# Altium project pca10040.PrjPCB (part 2 of 3)

## Sheet sheet4_buttons_and_leds.SchDoc: Buttons and LEDs
size A3; Organization: Nordic Semiconductor; DocumentNumber: 4; Revision: 3.0.0; SheetNumber: 4; SheetTotal: 6; Author: KJP/RUBR/GETR/SIGE; CompanyName: Nordic Semiconductor; DrawnBy: KJP/RUBR/GETR/SIGE; DocumentSize: A3
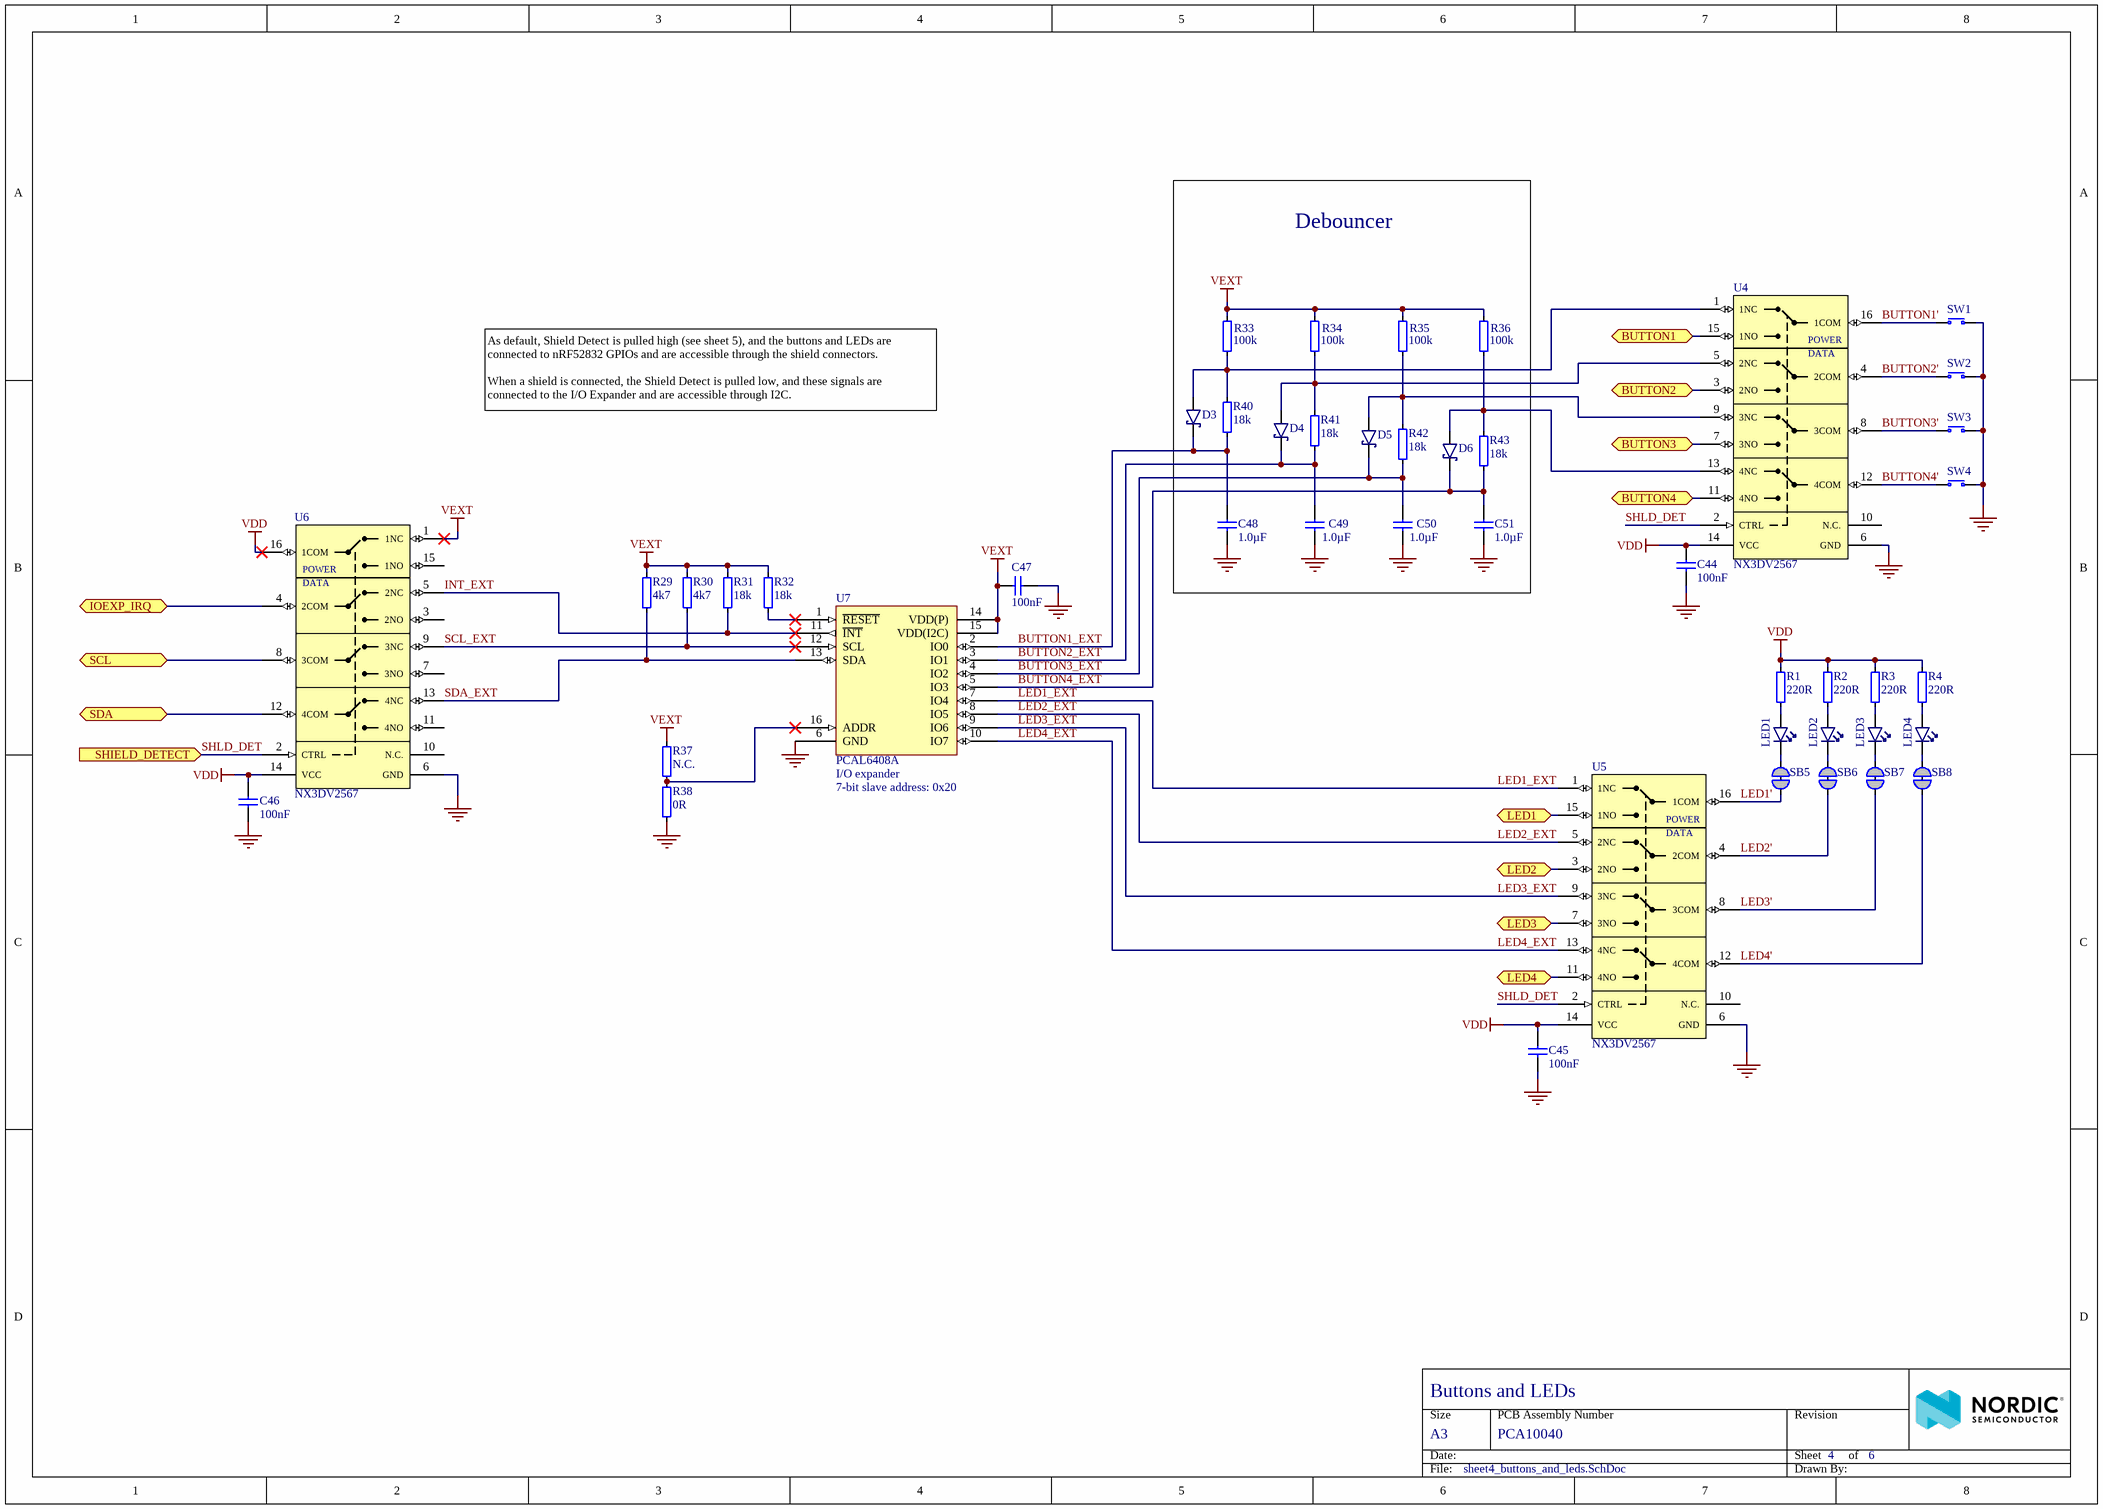
[diagram p3: sheet4_buttons_and_leds.SchDoc]

### Parts
C44  100nF  [CAPC1005X04L]
C45  100nF  [CAPC1005X04L]
C46  100nF  [CAPC1005X04L]
C47  100nF  [CAPC1005X04L]
C48  1.0µF  [CAPC1005X04L]
C49  1.0µF  [CAPC1005X04L]
C50  1.0µF  [CAPC1005X04L]
C51  1.0µF  [CAPC1005X04L]
D3  1PS79SB30.115  [SOD-523]  (value not drawn)
D4  1PS79SB30.115  [SOD-523]  (value not drawn)
D5  1PS79SB30.115  [SOD-523]  (value not drawn)
D6  1PS79SB30.115  [SOD-523]  (value not drawn)
LED1  L0603G  [LED_0603_G]  (value not drawn)
LED2  L0603G  [LED_0603_G]  (value not drawn)
LED3  L0603G  [LED_0603_G]  (value not drawn)
LED4  L0603G  [LED_0603_G]  (value not drawn)
R1  220R  [RESC1005X04L]
R2  220R  [RESC1005X04L]
R3  220R  [RESC1005X04L]
R4  220R  [RESC1005X04L]
R29  4k7  [RESC1005X04L]
R30  4k7  [RESC1005X04L]
R31  18k  [RESC1005X04L]
R32  18k  [RESC1005X04L]
R33  100k  [RESC1005X04L]
R34  100k  [RESC1005X04L]
R35  100k  [RESC1005X04L]
R36  100k  [RESC1005X04L]
R37  N.C.  [RESC1005X04L_NC]
R38  0R  [RESC1005X04L]
R40  18k  [RESC1005X04L]
R41  18k  [RESC1005X04L]
R42  18k  [RESC1005X04L]
R43  18k  [RESC1005X04L]
SB5  Solderbridge  [Solderbridge_Shorted]  (value not drawn)  (net tie, no BOM)
SB6  Solderbridge  [Solderbridge_Shorted]  (value not drawn)  (net tie, no BOM)
SB7  Solderbridge  [Solderbridge_Shorted]  (value not drawn)  (net tie, no BOM)
SB8  Solderbridge  [Solderbridge_Shorted]  (value not drawn)  (net tie, no BOM)
SW1  PB SW  [Switch-PB-6.2x6.3mm-SMD]  (value not drawn)
SW2  PB SW  [Switch-PB-6.2x6.3mm-SMD]  (value not drawn)
SW3  PB SW  [Switch-PB-6.2x6.3mm-SMD]  (value not drawn)
SW4  PB SW  [Switch-PB-6.2x6.3mm-SMD]  (value not drawn)
U4  NX3DV2567  [XQFN40P180X260X50-16N]
U5  NX3DV2567  [XQFN40P180X260X50-16N]
U6  NX3DV2567  [XQFN40P180X260X50-16N]
U7  PCAL6408A  [XQFN40P180X260X50-16N]

### Blocks framed on the sheet
Debouncer: C48-C51 D3-D6 R33-R36 R40-R43

### Ports
BUTTON1 (bidir), BUTTON2 (bidir), BUTTON3 (bidir), BUTTON4 (bidir), IOEXP_IRQ (bidir), LED1 (bidir), LED2 (bidir), LED3 (bidir), LED4 (bidir), SCL (bidir), SDA (bidir), SHIELD_DETECT (in)

### Nets
GND: C44.1 C45.1 C46.1 C47.1 C48.2 C49.1 C50.1 C51.2 R38.1 SW1.1(N.O) SW2.1(N.O) SW3.1(N.O) SW4.1(N.O) U4.6(GND) U5.6(GND) U6.6(GND) U7.6(GND)
VDD: C44.2 C45.2 C46.2 R1.2 R2.2 R3.2 R4.2 U4.14(VCC) U5.14(VCC) U6.14(VCC) U6.16(1COM)
VEXT: C47.2 R29.2 R30.2 R31.2 R32.2 R33.2 R34.2 R35.2 R36.2 R37.2 U6.1(1NC) U7.14(VDD(P)) U7.15(VDD(I2C))
BUTTON1': SW1.2(COM) U4.16(1COM)
BUTTON1_EXT: C48.1 D3.3(C) R40.1 U7.2(IO0)
BUTTON2': SW2.2(COM) U4.4(2COM)
BUTTON2_EXT: C49.2 D4.3(C) R41.1 U7.3(IO1)
BUTTON3': SW3.2(COM) U4.8(3COM)
BUTTON3_EXT: C50.2 D5.3(C) R42.1 U7.4(IO2)
BUTTON4': SW4.2(COM) U4.12(4COM)
BUTTON4_EXT: C51.1 D6.3(C) R43.1 U7.5(IO3)
D2: U4.15(1NO) ; port BUTTON1
D3: U4.3(2NO) ; port BUTTON2
D4: U4.7(3NO) ; port BUTTON3
D5: U4.11(4NO) ; port BUTTON4
D6: U5.15(1NO) ; port LED1
D7: U5.3(2NO) ; port LED2
D8: U5.7(3NO) ; port LED3
D9: U5.11(4NO) ; port LED4
INT_EXT: R31.1 U6.5(2NC) U7.11(~{INT})
LED1': SB5.1 U5.16(1COM)
LED1_EXT: U5.1(1NC) U7.7(IO4)
LED2': SB6.1 U5.4(2COM)
LED2_EXT: U5.5(2NC) U7.8(IO5)
LED3': SB7.1 U5.8(3COM)
LED3_EXT: U5.9(3NC) U7.9(IO6)
LED4': SB8.1 U5.12(4COM)
LED4_EXT: U5.13(4NC) U7.10(IO7)
P0.26: U6.12(4COM) ; port SDA
P0.27: U6.8(3COM) ; port SCL
SCL_EXT: R30.1 U6.9(3NC) U7.12(SCL)
SDA_EXT: R29.1 U6.13(4NC) U7.13(SDA)
SHLD_DET: U4.2(CTRL) U5.2(CTRL) U6.2(CTRL) ; port SHIELD_DETECT
NetD3_1: D3.1(A) R33.1 R40.2 U4.1(1NC)
NetD4_1: D4.1(A) R34.1 R41.2 U4.5(2NC)
NetD5_1: D5.1(A) R35.1 R42.2 U4.9(3NC)
NetD6_1: D6.1(A) R36.1 R43.2 U4.13(4NC)
NetLED1_1: LED1.1(C) SB5.2
NetLED1_2: LED1.2(A) R1.1
NetLED2_1: LED2.1(C) SB6.2
NetLED2_2: LED2.2(A) R2.1
NetLED3_1: LED3.1(C) SB7.2
NetLED3_2: LED3.2(A) R3.1
NetLED4_1: LED4.1(C) SB8.2
NetLED4_2: LED4.2(A) R4.1
NetR32_1: R32.1 U7.1(~{RESET})
NetR37_1: R37.1 R38.2 U7.16(ADDR)
NetSB30_2: U6.4(2COM) ; port IOEXP_IRQ

Not connected (* = marked no-connect by the designer): U4 10(N.C.); U5 10(N.C.); U6 3(2NO) 7(3NO) 10(N.C.) 11(4NO) 15(1NO)

### Notes on the sheet
- As default, Shield Detect is pulled high (see sheet 5), and the buttons and LEDs are connected to nRF52832 GPIOs and are accessible through the shield connectors.
  When a shield is connected, the Shield Detect is pulled low, and these signals are connected to the I/O Expander and are accessible through I2C.
- (near U7) I/O expander
- (near U7) 7-bit slave address: 0x20
- Size
- Date:
- A3
- PCB Assembly Number
- Sheet         of
- Revision
- File:
- Drawn By:
- (in symbol NX3DV2567GU) POWER; DATA

### Library data of the parts
C44-C47 = C0402-100n: Capacitor, X7R, ±10%; Manufacturer: N.A.; Part number IPS: 00000005296; Note: 16V; Artikkelnr Noca: 20039200; Pad Count: 2; Part Number: C0402-100n; Manufacturer Part Number: N.A.; Footprint Doc: 0402; LatestRevisionDate: 2009-11-23; Published: 2009-05-08; Value: 100nF; ComponentLink1URL: N.A.; ComponentLink1Description: Datasheet; ComponentLink2URL: N.A.; ComponentLink2Description: Supplier link; HelpURL: N.A.; Supplier 1: N.A.; Supplier Part Number 1: N.A.; Supplier 2: N.A.; Supplier Part Number 2: N.A.; PartId: 100200184; Component Class: Capacitors; Author: rsk; Part number Norautron: N.A.
C48-C51 = C0402-1µ0: Capacitor, X5R, ±5%, 6.3V; Manufacturer: N.A.; Part number IPS: 00000007786, 00000003457; Artikkelnr Noca: 20039235; Pad Count: 2; Part Number: C0402-1µ0; Manufacturer Part Number: N.A.; Footprint Doc: 0402; LatestRevisionDate: 2016-08-22; Published: 2009-05-08; Value: 1.0µF; Note: 6.3V; ComponentLink1URL: N.A.; ComponentLink1Description: Datasheet; ComponentLink2URL: N.A.; ComponentLink2Description: Supplier link; HelpURL: N.A.; Supplier 1: Digi-Key; Supplier Part Number 1: 1276-1444-1-ND; Supplier 2: N.A.; Supplier Part Number 2: N.A.; PartId: 100200190; Component Class: Capacitors; Author: rsk; Part number Norautron: N.A.
D3-D6 = 1PS79SB30.115: Diode Schottky Vf=0.38, Vr=40V, If=200mA, Ir=500nA; Manufacturer: NXP Semiconductors; Note: N.A.; Artikkelnr Noca: 10029120; Pad Count: 2; Part Number: 1PS79SB30.115; Manufacturer Part Number: 1PS79SB30.115; Footprint Doc: SOD-523; LatestRevisionDate: 2016-08-26; Published: 2014-09-24; Value: 1PS79SB30.115; Part number IPS: N.A.; ComponentLink1URL: N.A.; ComponentLink1Description: Datasheet; ComponentLink2URL: N.A.; ComponentLink2Description: Supplier link; HelpURL: http://www.nxp.com/documents/data_sheet/1PS79SB30.pdf; Supplier 1: Digi-Key; Supplier Part Number 1: 568-5973-1-ND; Supplier 2: Farnell; Supplier Part Number 2: 873-4097; PartId: 101300094; Component Class: Semiconductors; Author: rsk; Part number Norautron: N.A.
LED1-LED4 = LG L29K Smartled Green: LED, Green, 0603, 570nm, Vf=1.7V, 2.24..5.6mcd, - 40 to +100°C; Manufacturer: Osram; Manufacturer Part Number: LG L29K-G2J1-24-Z; Part number IPS: 00000009961; Part number Norautron: N.A.; Note: 2.24..5.6 mcd, Vfmin=1.7V; Artikkelnr Noca: 13019147; Pad Count: 2; Part Number: LG L29K Smartled Green; Footprint Doc: 0603; LatestRevisionDate: 2017-08-21; Published: 2014-10-28; Value: L0603G; ComponentLink1URL: N.A.; ComponentLink1Description: Datasheet; ComponentLink2URL: N.A.; ComponentLink2Description: Supplier link; HelpURL: http://www.osram-os.com/Graphics/XPic2/00077107_0.pdf; Supplier 1: Digi-Key; Supplier Part Number 1: 475-2709-1-ND; Supplier 2: Mouser; Supplier Part Number 2: 720-LGL29KG2J124Z; PartId: 101400096; Component Class: Optoelectronics; Author: rsk
R1-R4 = R0402-220: Resistor, ±1%, 0.063W; Manufacturer: N.A.; Note: Chip Res 1%; Artikkelnr Noca: 27049057; Pad Count: 2; Part Number: R0402-220; Manufacturer Part Number: N.A.; LatestRevisionDate: 2009-11-23; Published: 2009-05-08; Value: 220R; Footprint Doc: 0402; Part number IPS: N.A.; ComponentLink1URL: N.A.; ComponentLink1Description: Datasheet; ComponentLink2URL: N.A.; ComponentLink2Description: Supplier link; HelpURL: N.A.; Supplier 1: Farnell; Supplier Part Number 1: 173-8841; Supplier 2: N.A.; Supplier Part Number 2: N.A.; PartId: 100100156; Component Class: Resistors; Author: rsk; Part number Norautron: N.A.
R29 R30 = R0402-4k7: Resistor, ±1%, 0.063W; Manufacturer: N.A.; Part number IPS: 00000003433; Note: Chip Res 1%; Artikkelnr Noca: 27049089; Pad Count: 2; Part Number: R0402-4k7; Manufacturer Part Number: N.A.; Footprint Doc: 0402; LatestRevisionDate: 2009-11-23; Published: 2009-05-08; Value: 4k7; ComponentLink1URL: N.A.; ComponentLink1Description: Datasheet; ComponentLink2URL: N.A.; ComponentLink2Description: Supplier link; HelpURL: N.A.; Supplier 1: Farnell; Supplier Part Number 1: 173-8858; Supplier 2: N.A.; Supplier Part Number 2: N.A.; PartId: 100100190; Component Class: Resistors; Author: rsk; Part number Norautron: N.A.
R31 R32 R40-R43 = R0402-18k: Resistor, ±1%, 0.063W; Manufacturer: N.A.; Part number IPS: 00000003300; Note: Chip Res 1%; Artikkelnr Noca: 27049103; Pad Count: 2; Part Number: R0402-18k; Manufacturer Part Number: N.A.; Footprint Doc: 0402; LatestRevisionDate: 2009-11-23; Published: 2009-05-08; Value: 18k; ComponentLink1URL: N.A.; ComponentLink1Description: Datasheet; ComponentLink2URL: N.A.; ComponentLink2Description: Supplier link; HelpURL: N.A.; Supplier 1: Farnell; Supplier Part Number 1: 173-8867; Supplier 2: N.A.; Supplier Part Number 2: N.A.; PartId: 100100208; Component Class: Resistors; Author: rsk; Part number Norautron: N.A.
R33-R36 = R0402-100k: Resistor, ±1%, 0.063W; Manufacturer: N.A.; Part number IPS: 00000003667; Note: Chip Res 1%; Artikkelnr Noca: 27049121; Pad Count: 2; Part Number: R0402-100k; Manufacturer Part Number: N.A.; Footprint Doc: 0402; LatestRevisionDate: 2009-11-23; Published: 2009-05-08; Value: 100k; ComponentLink1URL: N.A.; ComponentLink1Description: Datasheet; ComponentLink2URL: N.A.; ComponentLink2Description: Supplier link; HelpURL: N.A.; Supplier 1: Farnell; Supplier Part Number 1: 173-8877; Supplier 2: N.A.; Supplier Part Number 2: N.A.; PartId: 100100239; Component Class: Resistors; Author: rsk; Part number Norautron: N.A.
R37 = R0402-N.C.: Not mounted; Manufacturer: N.A.; Note: Chip Res; Assembly: Not mounted; Pad Count: 2; Part Number: R0402-N.C.; Manufacturer Part Number: N.A.; Footprint Doc: 0402; LatestRevisionDate: 2009-05-08; Published: 2009-05-08; Value: N.C.; Artikkelnr Noca: N.A.; Part number IPS: N.A.; ComponentLink1URL: N.A.; ComponentLink1Description: Datasheet; ComponentLink2URL: N.A.; ComponentLink2Description: Supplier link; HelpURL: N.A.; Supplier 1: N.A.; Supplier Part Number 1: N.A.; Supplier 2: N.A.; Supplier Part Number 2: N.A.; PartId: 100100281; Component Class: Resistors; Author: rsk; Part number Norautron: N.A.
R38 = R0402-0R: Resistor, ±5%, 0.063W; Manufacturer: N.A.; Part number IPS: 00000007128; Note: Chip Res 5%; Artikkelnr Noca: 27049000; Pad Count: 2; Part Number: R0402-0R; Manufacturer Part Number: N.A.; Footprint Doc: 0402; LatestRevisionDate: 2009-11-23; Published: 2009-05-08; Value: 0R; ComponentLink1URL: N.A.; ComponentLink1Description: Datasheet; ComponentLink2URL: N.A.; ComponentLink2Description: Supplier link; HelpURL: N.A.; Supplier 1: Farnell; Supplier Part Number 1: 146-9661; Supplier 2: N.A.; Supplier Part Number 2: N.A.; PartId: 100100109; Component Class: Resistors; Author: rsk; Part number Norautron: N.A.
SB5-SB8 = Solderbridge Shorted: Shorted Solderbridge; Manufacturer: N.A.; Pad Count: 2; Part Number: Solderbridge Shorted; Manufacturer Part Number: N.A.; LatestRevisionDate: 2012-08-07; Published: 2012-08-07; Value: Solderbridge; Note: N.A.; Artikkelnr Noca: N.A.; Footprint Doc: Solderbridge_Shorted; Part number IPS: N.A.; ComponentLink1URL: N.A.; ComponentLink1Description: Datasheet; ComponentLink2URL: N.A.; ComponentLink2Description: Supplier link; HelpURL: N.A.; Supplier 1: N.A.; Supplier Part Number 1: N.A.; Supplier 2: N.A.; Supplier Part Number 2: N.A.; PartId: 100500459; Component Class: Connectors; Author: rsk; Part number Norautron: N.A.
SW1-SW4 = Switch-PB-6.2x6.3mm-SMD: Tactile Switch, SPNO, SMD, 160gf, 6.2x6.3x2.5mm; Manufacturer: Dailywell; Manufacturer Part Number: TS604VM1-025BR-R; Part number IPS: 00000007812; Note: N.A.; Artikkelnr Noca: 50019106; Pad Count: 4; Part Number: Switch-PB-6.2x6.3mm-SMD; Footprint Doc: Switch-PB-6.2x6.3mm-SMD; LatestRevisionDate: 2016-04-21; Published: 2010-02-01; Value: PB SW; ComponentLink1URL: N.A.; ComponentLink1Description: Datasheet; ComponentLink2URL: N.A.; ComponentLink2Description: Supplier link; HelpURL: \\hizz\pro\app9717\Datasheet\switches\Dailywell\TS604VM1-025BR-R.pdf; Supplier 1: Cabcon; Supplier Part Number 1: TS604VM1-025BR-R; Supplier 2: Mouser; Supplier Part Number 2: 688-SKHUALE010; PartId: 101500001; Component Class: Switches; Author: rsk; Part number Norautron: N.A.
U4-U6 = NX3DV2567GU: Low-ohmic four-pole double-throw analog switch; Manufacturer: NXP Semiconductors; Part number IPS: 00000007816; Pad Count: 16; Note: N.A.; Artikkelnr Noca: 15079317; Part Number: NX3DV2567GU; PartId: 101900290; Component Class: Misc_ICs; Author: rsk; Manufacturer Part Number: NX3DV2567GU; ComponentLink1URL: N.A.; ComponentLink1Description: Datasheet; ComponentLink2URL: N.A.; ComponentLink2Description: Supplier link; HelpURL: http://www.nxp.com/documents/data_sheet/NX3DV2567.pdf; Footprint Doc: XQFN-16; LatestRevisionDate: 2015-02-17; Published: 2015-02-17; Value: NX3DV2567; Supplier 1: Digi-Key; Supplier Part Number 1: 568-5206-1-ND; Supplier 2: Mouser; Supplier Part Number 2: 771-NX3DV2567GU115; Part number Norautron: N.A.
U7 = PCAL6408AHK: 8-bit I2C-bus I/O expander with interrupt output; Manufacturer: NXP Semiconductors; Part number IPS: 00000009987; Note: N.A.; Artikkelnr Noca: 15079321; Pad Count: 16; Part Number: PCAL6408AHK; Manufacturer Part Number: PCAL6408AHK; Footprint Doc: XQFN-16; LatestRevisionDate: 2015-04-29; Published: 2015-04-29; Value: PCAL6408A; ComponentLink1URL: N.A.; ComponentLink1Description: Datasheet; ComponentLink2URL: N.A.; ComponentLink2Description: Supplier link; HelpURL: http://www.nxp.com/documents/data_sheet/PCAL6408A.pdf; Supplier 1: Digi-Key; Supplier Part Number 1: 568-9944-1-ND; Supplier 2: Mouser; Supplier Part Number 2: 771-PCAL6408AHKX; PartId: 101900289; Component Class: Misc_ICs; Author: rsk; Part number Norautron: N.A.

## Sheet sheet5_connectors.SchDoc: Connectors
size A3; Organization: Nordic Semiconductor; DocumentNumber: 5; Revision: 3.0.0; SheetNumber: 5; SheetTotal: 6; Author: KJP/RUBR/GETR/SIGE; CompanyName: Nordic Semiconductor; DrawnBy: KJP/RUBR/GETR/SIGE; DocumentSize: A3
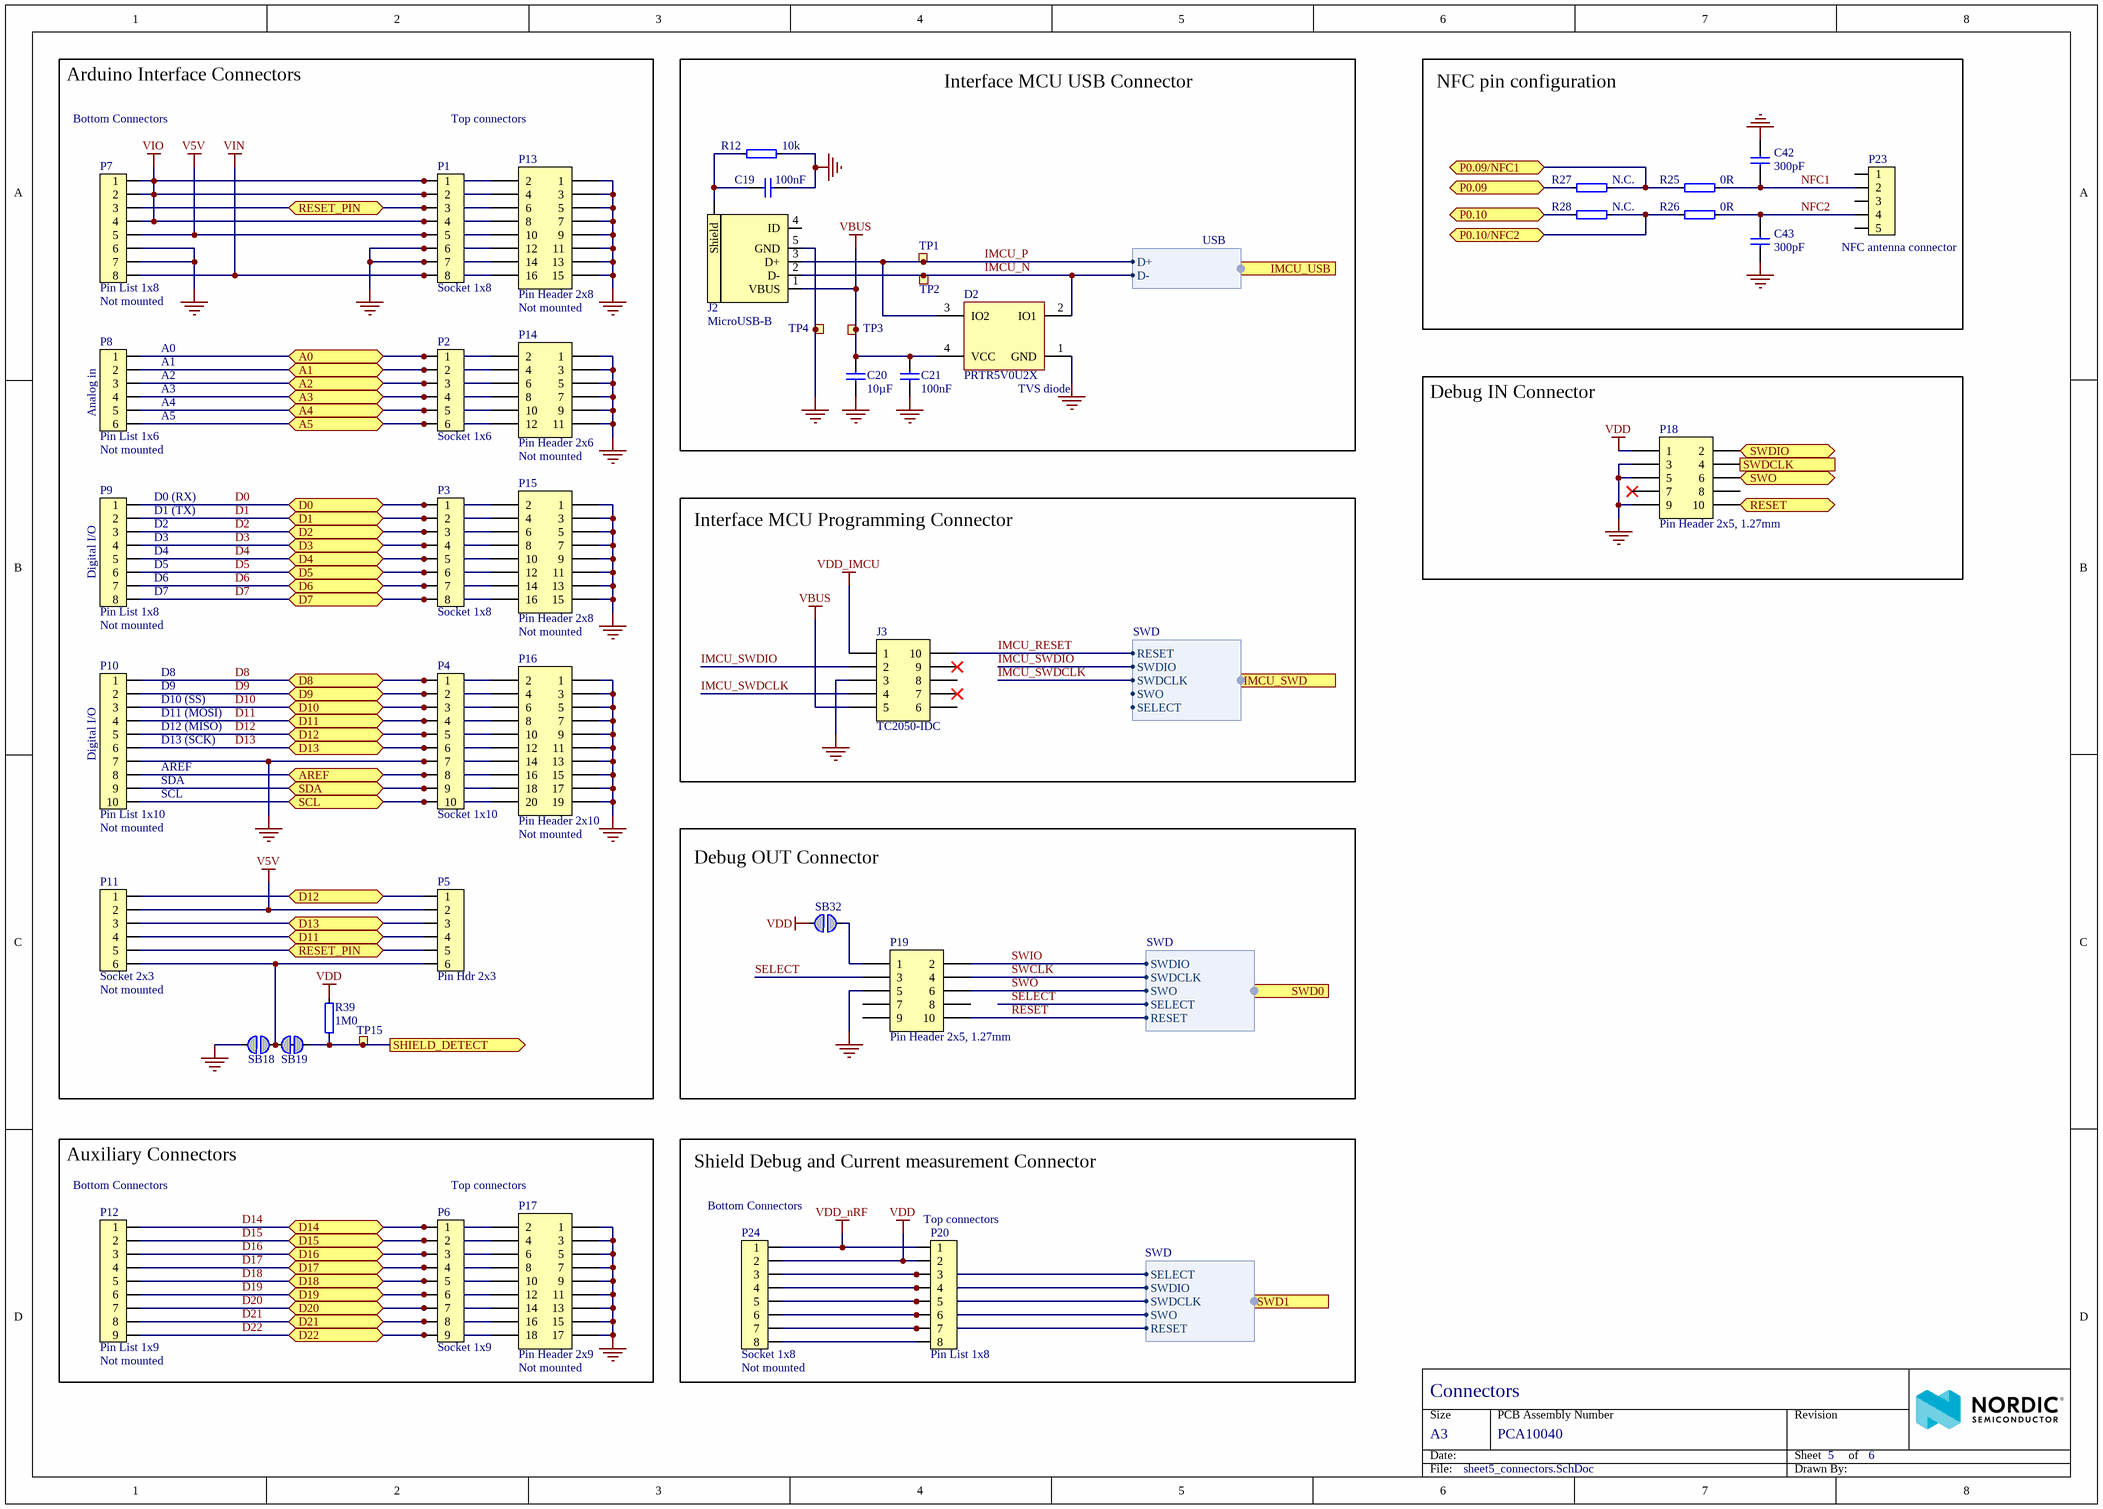
[diagram p4: sheet5_connectors.SchDoc]

### Parts
C19  100nF  [CAPC1005X04L]
C20  10µF  [CAPC1608X06L]
C21  100nF  [CAPC1005X04L]
C42  300pF  [CAPC1005X04L]
C43  300pF  [CAPC1005X04L]
D2  PRTR5V0U2X  [SOT190P230X110-4L]
J2  MicroUSB-B  [USB-Micro-B-RA-SMD-PiP]
J3  TC2050-IDC  [TC2050-IDC-NLFP]  (no BOM)
P1  Socket 1x8  [SOCKET_1x8_SMD]
P2  Socket 1x6  [SOCKET_1x6_SMD]
P3  Socket 1x8  [SOCKET_1x8_SMD]
P4  Socket 1x10  [SOCKET_1x10_SMD]
P5  Pin Hdr 2x3  [HDR_2x3-SMD]
P6  Socket 1x9  [SOCKET_1x9_SMD]
P7  Pin List 1x8  Assembly: Not mounted  [LIST_1x8_SMD-NC]
P8  Pin List 1x6  Assembly: Not mounted  [LIST_1x6_SMD-NC]
P9  Pin List 1x8  Assembly: Not mounted  [LIST_1x8_SMD-NC]
P10  Pin List 1x10  Assembly: Not mounted  [LIST_1x10_SMD-NC]
P11  Socket 2x3  Assembly: Not mounted  [SOCKET_2x3_SMD-2.54mm-bottom-NC]
P12  Pin List 1x9  Assembly: Not mounted  [LIST_1x9_SMD-NC]
P13  Pin Header 2x8  Assembly: Not mounted  [HDR_2x8-NC]
P14  Pin Header 2x6  Assembly: Not mounted  [HDR_2x6-NC]
P15  Pin Header 2x8  Assembly: Not mounted  [HDR_2x8-NC]
P16  Pin Header 2x10  Assembly: Not mounted  [HDR_2x10-NC]
P17  Pin Header 2x9  Assembly: Not mounted  [HDR_2x9-NC]
P18  Pin Header 2x5, 1.27mm  [HDR_2x5-SMD-1.27mm-K]
P19  Pin Header 2x5, 1.27mm  [HDR_2x5-SMD-1.27mm-K]
P20  Pin List 1x8  [LIST_1x8_SMD]
P23  FPC 0.5mm RA SMD  [FPC_05P-0.5mm-RA-SMD]  (value not drawn)
P24  Socket 1x8  Assembly: Not mounted  [LIST_1x8_SMD-NC]
R12  10k  [RESC1005X04L]
R25  0R  [RESC1005X04L]
R26  0R  [RESC1005X04L]
R27  N.C.  [RESC1005X04L_NC]
R28  N.C.  [RESC1005X04L_NC]
R39  1M0  [RESC1005X04L]
SB18  Solderbridge  [Solderbridge]  (value not drawn)  (no BOM)
SB19  Solderbridge  [Solderbridge_Shorted]  (value not drawn)  (net tie, no BOM)
SB32  Solderbridge  [Solderbridge]  (value not drawn)  (no BOM)
TP1  Ø1.0mm,SMD  [TP_SMD_D1.0mm]  (value not drawn)  (no BOM)
TP2  Ø1.0mm,SMD  [TP_SMD_D1.0mm]  (value not drawn)  (no BOM)
TP3  Ø1.0mm,SMD  [TP_SMD_D1.0mm]  (value not drawn)  (no BOM)
TP4  Ø1.0mm,SMD  [TP_SMD_D1.0mm]  (value not drawn)  (no BOM)
TP15  Ø1.0mm,SMD  [TP_SMD_D1.0mm]  (value not drawn)  (no BOM)

### Blocks framed on the sheet
Arduino Interface Connectors: P1-P5 P7-P11 P13-P16 R39 SB18 SB19 TP15
Interface MCU USB Connector: C19-C21 D2 J2 R12 TP1-TP4
NFC pin configuration: C42 C43 P23 R25-R28
Debug IN Connector: P18
Interface MCU Programming Connector: J3
Debug OUT Connector: P19 SB32
Auxiliary Connectors: P6 P12 P17
Shield Debug and Current measurement Connector: P20 P24

### Ports
A0 (bidir), A1 (bidir), A2 (bidir), A3 (bidir), A4 (bidir), A5 (bidir), AREF (bidir), D0 (bidir), D1 (bidir), D2 (bidir), D3 (bidir), D4 (bidir), D5 (bidir), D6 (bidir), D7 (bidir), D8 (bidir), D9 (bidir), D10 (bidir), D11 (bidir), D12 (bidir), D13 (bidir), D14 (bidir), D15 (bidir), D16 (bidir), D17 (bidir), D18 (bidir), D19 (bidir), D20 (bidir), D21 (bidir), D22 (bidir), IMCU_SWD (harness SWD), IMCU_USB (harness USB), P0.09 (bidir), P0.09/NFC1 (bidir), P0.10 (bidir), P0.10/NFC2 (bidir), RESET (bidir), RESET_PIN (bidir), SCL (bidir), SDA (bidir), SHIELD_DETECT (out), SWD0 (harness SWD), SWD1 (harness SWD), SWDCLK (out), SWDIO (bidir), SWO (bidir)

### Harnesses
SWD: SWDIO, SWDCLK, SWO, RESET, SELECT
USB: D-, D+

### Nets
GND: C19.1 C20.1 C21.1 C42.2 C43.1 D2.1(GND) J2.5(GND) J3.3 P1.6 P1.7 P4.7 P7.6 P7.7 P10.7 P13.1 P13.3 P13.5 P13.7 P13.9 P13.11 P13.12 P13.13 P13.14 P13.15 P14.1 P14.3 P14.5 P14.7 P14.9 P14.11 P15.1 P15.3 P15.5 P15.7 P15.9 P15.11 P15.13 P15.15 P16.1 P16.3 P16.5 P16.7 P16.9 P16.11 P16.13 P16.14 P16.15 P16.17 P16.19 P17.1 P17.3 P17.5 P17.7 P17.9 P17.11 P17.13 P17.15 P17.17 P18.3 P18.5 P18.9 P19.5 R12.1 SB18.1 TP4.1
V5V: P1.5 P5.2 P7.5 P11.2 P13.10
VBUS: C20.2 C21.2 D2.4(VCC) J2.1(VBUS) J3.5 TP3.1
VDD: P18.1 P20.2 P24.2 R39.2 SB32.1
VDD_IMCU: J3.1
VDD_nRF: P20.1 P24.1
VIN: P1.8 P7.8 P13.16
VIO: P1.1 P1.2 P1.4 P7.1 P7.2 P7.4 P13.2 P13.4 P13.8
D0: P3.1 P9.1 P15.2 ; port D0
D1: P3.2 P9.2 P15.4 ; port D1
D2: P3.3 P9.3 P15.6 ; port D2
D3: P3.4 P9.4 P15.8 ; port D3
D4: P3.5 P9.5 P15.10 ; port D4
D5: P3.6 P9.6 P15.12 ; port D5
D6: P3.7 P9.7 P15.14 ; port D6
D7: P3.8 P9.8 P15.16 P18.6 ; port SWO, port D7
D8: P4.1 P10.1 P16.2 ; port D8
D9: P4.2 P10.2 P16.4 ; port D9
D10: P4.3 P10.3 P16.6 ; port D10
D11: P4.4 P5.4 P10.4 P11.4 P16.8 ; port D11
D12: P4.5 P5.1 P10.5 P11.1 P16.10 ; port D12
D13: P4.6 P5.3 P10.6 P11.3 P16.12 ; port D13
D14: P6.1 P12.1 P17.2 ; port D14
D15: P6.2 P12.2 P17.4 ; port D15
D16: P6.3 P12.3 P17.6 P18.10 ; port RESET, port D16
D17: P6.4 P12.4 P17.8 ; port D17
D18: P6.5 P12.5 P17.10 ; port D18
D19: P6.6 P12.6 P17.12 ; port D19
D20: P6.7 P12.7 P17.14 ; port D20
D21: P6.8 P12.8 P17.16 R27.1 ; port D21, port P0.09
D22: P6.9 P12.9 P17.18 R28.1 ; port D22, port P0.10
IMCU_N: D2.2(IO1) J2.2(D-) TP2.1 ; port IMCU_USB.D-
IMCU_P: D2.3(IO2) J2.3(D+) TP1.1 ; port IMCU_USB.D+
IMCU_RESET: J3.10 ; port IMCU_SWD.RESET
IMCU_SWDCLK: J3.4 ; port IMCU_SWD.SWDCLK
IMCU_SWDIO: J3.2 ; port IMCU_SWD.SWDIO
NFC1: C42.1 P23.2 R25.1
NFC2: C43.2 P23.4 R26.1
P0.02: P4.8 P10.8 P16.16 ; port AREF
P0.03: P2.1 P8.1 P14.2 ; port A0
P0.04: P2.2 P8.2 P14.4 ; port A1
P0.09/NFC1: R25.2 R27.2 ; port P0.09/NFC1
P0.10/NFC2: R26.2 R28.2 ; port P0.10/NFC2
P0.26: P4.9 P10.9 P16.18 ; port SDA
P0.27: P4.10 P10.10 P16.20 ; port SCL
P0.28: P2.3 P8.3 P14.6 ; port A2
P0.29: P2.4 P8.4 P14.8 ; port A3
P0.30: P2.5 P8.5 P14.10 ; port A4
P0.31: P2.6 P8.6 P14.12 ; port A5
RESET: P19.10 ; port SWD0.RESET
SELECT: P19.3 ; port SWD0.SELECT
SHLD_DET: R39.1 SB19.2 TP15.1 ; port SHIELD_DETECT
SWCLK: P19.4 ; port SWD0.SWDCLK
SWD1_SEL': P20.3 P24.3 ; port SWD1.SELECT
SWDCLK: P18.4 ; port SWDCLK
SWDIO: P18.2 ; port SWDIO
SWIO: P19.2 ; port SWD0.SWDIO
SWO: P19.6 ; port SWD0.SWO
NetC19_2: C19.2 J2.6(Shield) R12.2
NetP1_3: P1.3 P5.5 P7.3 P11.5 P13.6 ; port RESET_PIN
NetP5_6: P5.6 P11.6 SB18.2 SB19.1
NetP19_1: P19.1 SB32.2
NetP20_4: P20.4 P24.4 ; port SWD1.SWDIO
NetP20_5: P20.5 P24.5 ; port SWD1.SWDCLK
NetP20_6: P20.6 P24.6 ; port SWD1.SWO
NetP20_7: P20.7 P24.7 ; port SWD1.RESET
NetP20_8: P20.8 P24.8

Not connected (* = marked no-connect by the designer): J2 4(ID); J3 6 7* 8 9*; P18 7* 8; P19 7 8 9; P23 1 3 5

### Notes on the sheet
- Bottom Connectors
- Top connectors
- (near P23) NFC antenna connector
- (near P8) A0
- (near P8) A1
- (near P8) A2
- (near P8) Analog in
- (near P8) A3
- (near P8) A4
- (near P8) A5
- (near D2) TVS diode
- (near P9) D0 (RX)
- (near P9) D1 (TX)
- (near P9) Digital I/O
- (near P9) D2
- (near P9) D3
- (near P9) D4
- (near P9) D5
- (near P9) D6
- (near P9) D7
- (near P10) D8
- (near P10) D9
- (near P10) D10 (SS)
- (near P10) D11 (MOSI)
- (near P10) Digital I/O
- (near P10) AREF
- (near P10) D12 (MISO)
- (near P10) D13 (SCK)
- (near P10) SDA
- (near P10) SCL
- (near P12) Bottom Connectors
- (near P24) Bottom Connectors
- (near P20) Top connectors
- Size
- Date:
- PCB Assembly Number
- Sheet         of
- Revision
- File:
- Drawn By:

### Library data of the parts
C19 C21 = C0402-100n: as C44 on sheet sheet4_buttons_and_leds; Part Number: C0402-100n; Manufacturer Part Number: N.A.; LatestRevisionDate: 2009-11-23; Published: 2009-05-08; Value: 100nF; Footprint Doc: 0402; ComponentLink1URL: N.A.; ComponentLink1Description: Datasheet; ComponentLink2URL: N.A.; ComponentLink2Description: Supplier link; HelpURL: N.A.; Supplier 1: N.A.; Supplier Part Number 1: N.A.; Supplier 2: N.A.; Supplier Part Number 2: N.A.; PartId: 100200184; Component Class: Capacitors; Author: rsk; Part number Norautron: N.A.
C20 = C0603-10µ: Capacitor, X5R, ±20%; Manufacturer: N.A.; Part number IPS: 00000007785; Note: 6.3V; Artikkelnr Noca: 20039234; Pad Count: 2; Part Number: C0603-10µ; Manufacturer Part Number: N.A.; LatestRevisionDate: 2011-01-17; Published: 2011-01-17; Value: 10µF; Footprint Doc: 0603; ComponentLink1URL: N.A.; ComponentLink1Description: Datasheet; ComponentLink2URL: N.A.; ComponentLink2Description: Supplier link; HelpURL: N.A.; Supplier 1: N.A.; Supplier Part Number 1: N.A.; Supplier 2: N.A.; Supplier Part Number 2: N.A.; PartId: 100200275; Component Class: Capacitors; Author: rsk; Part number Norautron: N.A.
C42 C43 = C0402-300p: Capacitor, C0G, ±5%, 50V; Manufacturer: N.A.; Part number IPS: 00000007788; Artikkelnr Noca: 20020004; Pad Count: 2; Part Number: C0402-300p; Manufacturer Part Number: N.A.; Footprint Doc: 0402; LatestRevisionDate: 2020-10-13; Published: 2015-05-29; Value: 300pF; Note: 50V; ComponentLink1URL: N.A.; ComponentLink1Description: Datasheet; ComponentLink2URL: N.A.; ComponentLink2Description: Supplier link; HelpURL: N.A.; Supplier 1: Digi-Key; Supplier Part Number 1: 490-3234-1-ND; Supplier 2: N.A.; Supplier Part Number 2: N.A.; PartId: 100200155; Component Class: Capacitors; Author: rsk; Part number Norautron: N.A.
D2 = PRTR5V0U2X: Ultra low capacitance double rail-to-rail ESD protection diode; Manufacturer: NXP Semiconductors; Part number IPS: 00000009951; Note: N.A.; Artikkelnr Noca: 10069015; Pad Count: 4; Part Number: PRTR5V0U2X; Manufacturer Part Number: PRTR5V0U2X; LatestRevisionDate: 2017-11-09; Published: 2012-06-11; Value: PRTR5V0U2X; Footprint Doc: SOT-143B; ComponentLink1URL: N.A.; ComponentLink1Description: Datasheet; ComponentLink2URL: N.A.; ComponentLink2Description: Supplier link; HelpURL: http://www.farnell.com/datasheets/109718.pdf; Supplier 1: Digi-Key; Supplier Part Number 1: 568-4140-1-ND; Supplier 2: Farnell; Supplier Part Number 2: 152-4157; PartId: 101300082; Component Class: Semiconductors; Author: rsk; Part number Norautron: N.A.
J2 = USB-Micro-B-RA-SMD-PiP: MicroUSB-B-SMT; Manufacturer: Allen Creations Corp.; Manufacturer Part Number: AJU55-BS2111-L; Part number IPS: 00000007790; Note: N.A.; Artikkelnr Noca: 55029020; Pad Count: 5; Part Number: USB-Micro-B-RA-SMD-PiP; Footprint Doc: USB-Micro-B-RA-SMD-PiP; LatestRevisionDate: 2016-04-21; Published: 2014-10-07; Value: MicroUSB-B; ComponentLink1URL: N.A.; ComponentLink1Description: Datasheet; ComponentLink2URL: N.A.; ComponentLink2Description: Supplier link; HelpURL: \\hizz\pro\app9717\Datasheet\connectors\Allen Creations Corp\AJU-211.pdf; Supplier 1: Cabcon; Supplier Part Number 1: AJU55-BS2111-L; Supplier 2: Digi-Key; Supplier Part Number 2: 609-4616-1-ND; PartId: 100500490; Component Class: Connectors; Author: rsk; Part number Norautron: N.A.
J3 = TC2050-IDC-NLFP: CBL PLUG-OF-NAILS 10-PIN; Manufacturer: Tag-Connect LLC; Artikkelnr Noca: N.A.; Pad Count: 10; Part Number: TC2050-IDC-NLFP; Manufacturer Part Number: TC2050-IDC-NLFP; LatestRevisionDate: 2012-11-21; Published: 2012-11-21; Value: TC2050-IDC; Footprint Doc: TC2050-IDC-NLFP; Part number IPS: N.A.; ComponentLink1URL: N.A.; ComponentLink1Description: Datasheet; ComponentLink2URL: N.A.; ComponentLink2Description: Supplier link; HelpURL: http://www.tag-connect.com/Materials/TC2050-IDC%20Datasheet.pdf; Supplier 1: Digi-Key; Supplier Part Number 1: TC2050-IDC-NL-ND; Supplier 2: N.A.; Supplier Part Number 2: N.A.; PartId: 100500463; Component Class: Connectors; Author: rsk; Note: N.A.; Part number Norautron: N.A.
P1 P3 = Socket 1x8 SMD: Socket 1x8, 2.54mm (100mil), SMD; Manufacturer: W-CON; Manufacturer Part Number: 2171-108MS0CUNR1; Part number IPS: 00000009963; Note: N.A.; Artikkelnr Noca: 55030002; Pad Count: 8; Part Number: Socket 1x8 SMD; Footprint Doc: SOCKET_1x8_SMD; LatestRevisionDate: 2017-10-23; Published: 2016-01-22; Value: Socket 1x8; ComponentLink1URL: N.A.; ComponentLink1Description: Datasheet; ComponentLink2URL: N.A.; ComponentLink2Description: Supplier link; HelpURL: N.A.; Supplier 1: Cabcon; Supplier Part Number 1: 2171-108MS0CUNR1; Supplier 2: Samtec; Supplier Part Number 2: SSM-108-F-SV-P-TR; PartId: 100500412; Component Class: Connectors; Author: rsk; Part number Norautron: N.A.
P2 = Socket 1x6 SMD: Socket 1x6, 2.54mm (100mil), SMD; Manufacturer: W-CON; Manufacturer Part Number: 2171-106MS0CUNR1; Part number IPS: 00000009964; Note: N.A.; Artikkelnr Noca: 55030001; Pad Count: 6; Part Number: Socket 1x6 SMD; Footprint Doc: SOCKET_1x6_SMD; LatestRevisionDate: 2017-10-23; Published: 2016-01-22; Value: Socket 1x6; ComponentLink1URL: N.A.; ComponentLink1Description: Datasheet; ComponentLink2URL: N.A.; ComponentLink2Description: Supplier link; HelpURL: N.A.; Supplier 1: Cabcon; Supplier Part Number 1: 2171-106MS0CUNR1; Supplier 2: Samtec; Supplier Part Number 2: SSM-106-F-SV-P-TR; PartId: 100500408; Component Class: Connectors; Author: rsk; Part number Norautron: N.A.
P4 = Socket 1x10 SMD: Socket 1x10, 2.54mm (100mil), SMD; Manufacturer: W-CON; Manufacturer Part Number: 2171-110MS0CUNR1; Part number IPS: 00000009965; Note: N.A.; Artikkelnr Noca: 55030004; Pad Count: 10; Part Number: Socket 1x10 SMD; Footprint Doc: SOCKET_1x10_SMD; LatestRevisionDate: 2016-01-22; Published: 2016-01-22; Value: Socket 1x10; ComponentLink1URL: N.A.; ComponentLink1Description: Datasheet; ComponentLink2URL: N.A.; ComponentLink2Description: Supplier link; HelpURL: N.A.; Supplier 1: Cabcon; Supplier Part Number 1: 2171-110MS0CUNR1; Supplier 2: Samtec; Supplier Part Number 2: SSM-110-F-SV-P-TR; PartId: 100500416; Component Class: Connectors; Author: rsk; Part number Norautron: N.A.
P5 = Pin Header 2x3 SMD: Pin Header 2x3, 2.54mm (100mil) SMD; Manufacturer: W-CON; Manufacturer Part Number: 1125-1203S0M116R1; Part number IPS: 00000009966; Part number Norautron: N.A.; Artikkelnr Noca: 55010007; Pad Count: 6; Part Number: Pin Header 2x3 SMD; Footprint Doc: HDR_2x3-SMD; LatestRevisionDate: 2016-01-22; Published: 2016-01-22; Value: Pin Hdr 2x3; Note: SMD; ComponentLink1URL: N.A.; ComponentLink1Description: Datasheet; ComponentLink2URL: N.A.; ComponentLink2Description: Supplier link; HelpURL: \\hizz\pro\app9717\Datasheet\connectors\W-CON\1125-12XXXXMXXXXX.PDF; Supplier 1: Cabcon; Supplier Part Number 1: 1125-1203S0M116R1; Supplier 2: Samtec; Supplier Part Number 2: TSM-103-01-L-DV; PartId: 100500242; Component Class: Connectors; Author: rsk
P6 = Socket 1x9 SMD: Socket 1x9, 2.54mm (100mil), SMD; Manufacturer: W-CON; Manufacturer Part Number: 2171-109MS0CUNR1; Note: N.A.; Artikkelnr Noca: 55030003; Pad Count: 9; Part Number: Socket 1x9 SMD; Footprint Doc: SOCKET_1x9_SMD; LatestRevisionDate: 2017-10-23; Published: 2016-01-22; Value: Socket 1x9; Part number IPS: N.A.; ComponentLink1URL: N.A.; ComponentLink1Description: Datasheet; ComponentLink2URL: N.A.; ComponentLink2Description: Supplier link; HelpURL: N.A.; Supplier 1: Cabcon; Supplier Part Number 1: 2171-109MS0CUNR1; Supplier 2: Samtec; Supplier Part Number 2: SSM-109-L-SV-P-TR; PartId: 100500414; Component Class: Connectors; Author: rsk; Part number Norautron: N.A.
P7 P9 = Pin List 1x8 SMD, N.C.: Pin List 1x8, 2.54mm (100mil), SMD; Manufacturer: W-CON; Manufacturer Part Number: 1125-1108S0M116R2; Note: N.A.; Artikkelnr Noca: 55010006; Pad Count: 8; Part Number: Pin List 1x8 SMD, N.C.; LatestRevisionDate: 2016-01-22; Published: 2016-01-22; Value: Pin List 1x8; Footprint Doc: LIST_1x8_SMD; Part number IPS: N.A.; ComponentLink1URL: N.A.; ComponentLink1Description: Datasheet; ComponentLink2URL: N.A.; ComponentLink2Description: Supplier link; HelpURL: \\hizz\pro\app9717\Datasheet\connectors\W-CON\1125-11XXXXMXXXXX.pdf; Supplier 1: Cabcon; Supplier Part Number 1: 1125-1108S0M116R2; Supplier 2: Samtec; Supplier Part Number 2: TSM-108-01-L-SV-P-TR; PartId: 100500330; Component Class: Connectors; Author: rsk; Part number Norautron: N.A.
P8 = Pin List 1x6 SMD, N.C.: Pin List 1x6, 2.54mm (100mil), SMD; Manufacturer: W-CON; Manufacturer Part Number: 1125-1106S0M116R2; Note: N.A.; Artikkelnr Noca: 55010026; Pad Count: 6; Part Number: Pin List 1x6 SMD, N.C.; LatestRevisionDate: 2016-03-29; Published: 2016-03-29; Value: Pin List 1x6; Footprint Doc: LIST_1x6_SMD; Part number IPS: N.A.; ComponentLink1URL: N.A.; ComponentLink1Description: Datasheet; ComponentLink2URL: N.A.; ComponentLink2Description: Supplier link; HelpURL: \\hizz\pro\app9717\Datasheet\connectors\W-CON\1125-11XXXXMXXXXX.pdf; Supplier 1: Cabcon; Supplier Part Number 1: 1125-1106S0M116R2; Supplier 2: Samtec; Supplier Part Number 2: TSM-106-01-L-SV-P-TR; PartId: 100500321; Component Class: Connectors; Author: rsk; Part number Norautron: N.A.
P10 = Pin List 1x10 SMD, N.C.: Pin List 1x10, 2.54mm (100mil), SMD; Manufacturer: W-CON; Manufacturer Part Number: 1125-1110S0M116R2; Note: N.A.; Artikkelnr Noca: 55010028; Pad Count: 10; Part Number: Pin List 1x10 SMD, N.C.; LatestRevisionDate: 2016-03-29; Published: 2016-03-29; Value: Pin List 1x10; Footprint Doc: LIST_1x10_SMD; Part number IPS: N.A.; ComponentLink1URL: N.A.; ComponentLink1Description: Datasheet; ComponentLink2URL: N.A.; ComponentLink2Description: Supplier link; HelpURL: \\hizz\pro\app9717\Datasheet\connectors\W-CON\1125-11XXXXMXXXXX.pdf; Supplier 1: Cabcon; Supplier Part Number 1: 1125-1110S0M116R2; Supplier 2: Samtec; Supplier Part Number 2: TSM-110-01-L-SV-P-TR; PartId: 100500338; Component Class: Connectors; Author: rsk; Part number Norautron: N.A.
P11 = Socket 2x3 SMD Bottom, N.C.: Socket 2x3, 2.54mm (100mil), SMD; Manufacturer: W-CON; Manufacturer Part Number: 2171-203MS0CUNR1; Note: N.A.; Artikkelnr Noca: 55030010; Pad Count: 6; Part Number: Socket 2x3 SMD Bottom, N.C.; LatestRevisionDate: 2016-03-29; Published: 2014-06-10; Value: Socket 2x3; Footprint Doc: SOCKET_2x3_SMD-2.54mm-bottom; Part number IPS: N.A.; ComponentLink1URL: N.A.; ComponentLink1Description: Datasheet; ComponentLink2URL: N.A.; ComponentLink2Description: Supplier link; HelpURL: \\hizz\pro\app9717\Datasheet\connectors\W-CON\2171-2XXMXXCUNXX.pdf; Supplier 1: Cabcon; Supplier Part Number 1: 2171-203MS0CUNR1; Supplier 2: Samtec; Supplier Part Number 2: SSM-103-F-DV-P-TR; PartId: 100500434; Component Class: Connectors; Author: rsk; Part number Norautron: N.A.
P12 = Pin List 1x9 SMD, N.C.: Pin List 1x9, 2.54mm (100mil), SMD; Manufacturer: W-CON; Manufacturer Part Number: 1125-1109S0M116R2; Note: N.A.; Artikkelnr Noca: 55010024; Pad Count: 9; Part Number: Pin List 1x9 SMD, N.C.; LatestRevisionDate: 2016-06-02; Published: 2016-03-29; Value: Pin List 1x9; Footprint Doc: LIST_1x9_SMD; Part number IPS: N.A.; ComponentLink1URL: N.A.; ComponentLink1Description: Datasheet; ComponentLink2URL: N.A.; ComponentLink2Description: Supplier link; HelpURL: \\hizz\pro\app9717\Datasheet\connectors\W-CON\1125-11XXXXMXXXXX.pdf; Supplier 1: Cabcon; Supplier Part Number 1: 1125-1109S0M116R2; Supplier 2: Samtec; Supplier Part Number 2: TSM-109-01-L-SV-P-TR; PartId: 100500334; Component Class: Connectors; Author: rsk; Part number Norautron: N.A.
P13 P15 = Pin Header 2x8, N.C.: Pin Header 2x8, 2.54mm (100mil); Manufacturer: N.A.; Pad Count: 16; Part Number: Pin Header 2x8, N.C.; Manufacturer Part Number: N.A.; Footprint Doc: HDR_2x8; LatestRevisionDate: 2009-12-12; Published: 2009-12-12; Value: Pin Header 2x8; Note: N.A.; Artikkelnr Noca: N.A.; Part number IPS: N.A.; ComponentLink1URL: N.A.; ComponentLink1Description: Datasheet; ComponentLink2URL: N.A.; ComponentLink2Description: Supplier link; HelpURL: N.A.; Supplier 1: N.A.; Supplier Part Number 1: N.A.; Supplier 2: N.A.; Supplier Part Number 2: N.A.; PartId: 100500270; Component Class: Connectors; Author: rsk; Part number Norautron: N.A.
P14 = Pin Header 2x6, N.C.: Pin Header 2x6, 2.54mm (100mil); Manufacturer: N.A.; Pad Count: 12; Part Number: Pin Header 2x6, N.C.; Manufacturer Part Number: N.A.; Footprint Doc: HDR_2x6; LatestRevisionDate: 2014-07-04; Published: 2009-12-12; Value: Pin Header 2x6; Note: N.A.; Artikkelnr Noca: N.A.; Part number IPS: N.A.; ComponentLink1URL: N.A.; ComponentLink1Description: Datasheet; ComponentLink2URL: N.A.; ComponentLink2Description: Supplier link; HelpURL: N.A.; Supplier 1: N.A.; Supplier Part Number 1: N.A.; Supplier 2: N.A.; Supplier Part Number 2: N.A.; PartId: 100500265; Component Class: Connectors; Author: rsk; Part number Norautron: N.A.
P16 = Pin Header 2x10, N.C.: Pin Header 2x10, 2.54mm (100mil); Manufacturer: N.A.; Pad Count: 20; Part Number: Pin Header 2x10, N.C.; Manufacturer Part Number: N.A.; Footprint Doc: HDR_2x10; LatestRevisionDate: 2017-02-02; Published: 2017-01-30; Value: Pin Header 2x10; Note: N.A.; Artikkelnr Noca: N.A.; Part number IPS: N.A.; ComponentLink1URL: N.A.; ComponentLink1Description: Datasheet; ComponentLink2URL: N.A.; ComponentLink2Description: Supplier link; HelpURL: N.A.; Supplier 1: N.A.; Supplier Part Number 1: N.A.; Supplier 2: N.A.; Supplier Part Number 2: N.A.; PartId: 100500274; Component Class: Connectors; Author: rsk; Part number Norautron: N.A.
P17 = Pin Header 2x9, N.C.: Pin Header 2x9, 2.54mm (100mil); Manufacturer: N.A.; Pad Count: 18; Part Number: Pin Header 2x9, N.C.; Manufacturer Part Number: N.A.; Footprint Doc: HDR_2x9; LatestRevisionDate: 2011-07-06; Published: 2011-07-06; Value: Pin Header 2x9; Note: N.A.; Artikkelnr Noca: N.A.; Part number IPS: N.A.; ComponentLink1URL: N.A.; ComponentLink1Description: Datasheet; ComponentLink2URL: N.A.; ComponentLink2Description: Supplier link; HelpURL: N.A.; Supplier 1: N.A.; Supplier Part Number 1: N.A.; Supplier 2: N.A.; Supplier Part Number 2: N.A.; PartId: 100500272; Component Class: Connectors; Author: rsk; Part number Norautron: N.A.
P18 P19 = Pin Header 2x5 SMD, 1.27mm, KS: Pin Header 2x5, 1.27mm (50mil), SMD, Keying Shroud; Manufacturer: W-CON; Manufacturer Part Number: 3132-10MS0BK00R1; Part number IPS: 00000009968; Note: N.A.; Artikkelnr Noca: 55010009; Pad Count: 10; Part Number: Pin Header 2x5 SMD, 1.27mm, KS; Footprint Doc: HDR_2x5-SMD-1.27mm; LatestRevisionDate: 2016-04-21; Published: 2016-01-22; Value: Pin Header 2x5, 1.27mm; ComponentLink1URL: N.A.; ComponentLink1Description: Datasheet; ComponentLink2URL: N.A.; ComponentLink2Description: Supplier link; HelpURL: \\hizz\pro\app9717\Datasheet\connectors\W-CON\3132-XXMXXBK00XX.pdf; Supplier 1: Cabcon; Supplier Part Number 1: 3132-10MS0BK00R1; Supplier 2: Samtec; Supplier Part Number 2: FTSH-105-01-F-DV-K; PartId: 100500261; Component Class: Connectors; Author: rsk; Part number Norautron: N.A.
P20 = Pin List 1x8 SMD: Pin List 1x8, 2.54mm (100mil), SMD; Manufacturer: W-CON; Manufacturer Part Number: 1125-1108S0M116R2; Part number IPS: 00000001701; Note: N.A.; Artikkelnr Noca: 55010006; Pad Count: 8; Part Number: Pin List 1x8 SMD; Footprint Doc: LIST_1x8_SMD; LatestRevisionDate: 2016-01-22; Published: 2016-01-22; Value: Pin List 1x8; ComponentLink1URL: N.A.; ComponentLink1Description: Datasheet; ComponentLink2URL: N.A.; ComponentLink2Description: Supplier link; HelpURL: \\hizz\pro\app9717\Datasheet\connectors\W-CON\1125-11XXXXMXXXXX.pdf; Supplier 1: Cabcon; Supplier Part Number 1: 1125-1108S0M116R2; Supplier 2: Samtec; Supplier Part Number 2: TSM-108-01-L-SV-P-TR; PartId: 100500329; Component Class: Connectors; Author: rsk; Part number Norautron: N.A.
P23 = FPC_05P-0.5mm-RA-SMD: 0.5mm FPC, 5P,Right Angle SMT,Double Contact,H=1.2mm,White, Tin plated; Manufacturer: W-CON; Manufacturer Part Number: 5141-05RZDNWR01; Part number IPS: 00000007792; Note: N.A.; Artikkelnr Noca: 55010020; Pad Count: 7; Part Number: FPC_05P-0.5mm-RA-SMD; Footprint Doc: FPC_05P-0.5mm-RA-SMD; LatestRevisionDate: 2016-04-21; Published: 2015-06-22; Value: FPC 0.5mm RA SMD; ComponentLink1URL: N.A.; ComponentLink1Description: Datasheet; ComponentLink2URL: N.A.; ComponentLink2Description: Supplier link; HelpURL: \\hizz\pro\app9717\Datasheet\connectors\W-CON\5141-XXRZDNXX0X.pdf; Supplier 1: Cabcon; Supplier Part Number 1: 5141-05RZDNWR01; Supplier 2: Digi-Key; Supplier Part Number 2: WM9836CT-ND; PartId: 100500528; Component Class: Connectors; Author: rsk; Part number Norautron: N.A.
P24 = Socket 1x8 SMD, N.C.: Socket 1x8, 2.54mm (100mil), SMD; Manufacturer: W-CON; Manufacturer Part Number: 2171-108MS0CUNR1; Note: N.A.; Pad Count: 8; Part Number: Socket 1x8 SMD, N.C.; Footprint Doc: SOCKET_1x8_SMD; LatestRevisionDate: 2017-10-23; Published: 2017-09-07; Value: Socket 1x8; Artikkelnr Noca: N.A.; Part number IPS: N.A.; ComponentLink1URL: N.A.; ComponentLink1Description: Datasheet; ComponentLink2URL: N.A.; ComponentLink2Description: Supplier link; HelpURL: N.A.; Supplier 1: Cabcon; Supplier Part Number 1: 2171-108MS0CUNR1; Supplier 2: Samtec; Supplier Part Number 2: SSM-108-F-SV-P-TR; PartId: 100500413; Component Class: Connectors; Author: rsk; Part number Norautron: N.A.
R12 = R0402-10k: Resistor, ±1%, 0.063W; Manufacturer: N.A.; Part number IPS: 00000002093; Note: Chip Res 1%; Artikkelnr Noca: 27049097; Pad Count: 2; Value: 10k; Part Number: R0402-10k; Manufacturer Part Number: N.A.; LatestRevisionDate: 2009-11-23; Published: 2009-05-08; Footprint Doc: 0402; ComponentLink1URL: N.A.; ComponentLink1Description: Datasheet; ComponentLink2URL: N.A.; ComponentLink2Description: Supplier link; HelpURL: N.A.; Supplier 1: Farnell; Supplier Part Number 1: 173-8864; Supplier 2: N.A.; Supplier Part Number 2: N.A.; PartId: 100100198; Component Class: Resistors; Author: rsk; Part number Norautron: N.A.
R25 R26 = R0402-0R: as R38 on sheet sheet4_buttons_and_leds; Part Number: R0402-0R; Manufacturer Part Number: N.A.; Footprint Doc: 0402; LatestRevisionDate: 2009-11-23; Published: 2009-05-08; Value: 0R; ComponentLink1URL: N.A.; ComponentLink1Description: Datasheet; ComponentLink2URL: N.A.; ComponentLink2Description: Supplier link; HelpURL: N.A.; Supplier 1: Farnell; Supplier Part Number 1: 146-9661; Supplier 2: N.A.; Supplier Part Number 2: N.A.; PartId: 100100109; Component Class: Resistors; Author: rsk; Part number Norautron: N.A.
R27 R28 = R0402-N.C.: as R37 on sheet sheet4_buttons_and_leds; Part Number: R0402-N.C.; Manufacturer Part Number: N.A.; Footprint Doc: 0402; LatestRevisionDate: 2009-05-08; Published: 2009-05-08; Value: N.C.; Artikkelnr Noca: N.A.; Part number IPS: N.A.; ComponentLink1URL: N.A.; ComponentLink1Description: Datasheet; ComponentLink2URL: N.A.; ComponentLink2Description: Supplier link; HelpURL: N.A.; Supplier 1: N.A.; Supplier Part Number 1: N.A.; Supplier 2: N.A.; Supplier Part Number 2: N.A.; PartId: 100100281; Component Class: Resistors; Author: rsk; Part number Norautron: N.A.
R39 = R0402-1M0: Resistor, ±1%, 0.063W; Manufacturer: N.A.; Part number IPS: 00000006807; Note: Chip Res 1%; Artikkelnr Noca: 27049145; Pad Count: 2; Part Number: R0402-1M0; Manufacturer Part Number: N.A.; Footprint Doc: 0402; LatestRevisionDate: 2009-11-23; Published: 2009-05-08; Value: 1M0; ComponentLink1URL: N.A.; ComponentLink1Description: Datasheet; ComponentLink2URL: N.A.; ComponentLink2Description: Supplier link; HelpURL: N.A.; Supplier 1: N.A.; Supplier Part Number 1: N.A.; Supplier 2: N.A.; Supplier Part Number 2: N.A.; PartId: 100100265; Component Class: Resistors; Author: rsk; Part number Norautron: N.A.
SB18 SB32 = Solderbridge: Manufacturer: N.A.; Pad Count: 2; Part Number: Solderbridge; Manufacturer Part Number: N.A.; Footprint Doc: Solderbridge; LatestRevisionDate: 2009-12-14; Published: 2009-12-14; Value: Solderbridge; Note: N.A.; Artikkelnr Noca: N.A.; Part number IPS: N.A.; ComponentLink1URL: N.A.; ComponentLink1Description: Datasheet; ComponentLink2URL: N.A.; ComponentLink2Description: Supplier link; HelpURL: N.A.; Supplier 1: N.A.; Supplier Part Number 1: N.A.; Supplier 2: N.A.; Supplier Part Number 2: N.A.; PartId: 100500458; Component Class: Connectors; Author: rsk; Part number Norautron: N.A.
SB19 = Solderbridge Shorted: as SB5 on sheet sheet4_buttons_and_leds; Part Number: Solderbridge Shorted; Manufacturer Part Number: N.A.; Footprint Doc: Solderbridge_Shorted; LatestRevisionDate: 2012-08-07; Published: 2012-08-07; Value: Solderbridge; Note: N.A.; Artikkelnr Noca: N.A.; Part number IPS: N.A.; ComponentLink1URL: N.A.; ComponentLink1Description: Datasheet; ComponentLink2URL: N.A.; ComponentLink2Description: Supplier link; HelpURL: N.A.; Supplier 1: N.A.; Supplier Part Number 1: N.A.; Supplier 2: N.A.; Supplier Part Number 2: N.A.; PartId: 100500459; Component Class: Connectors; Author: rsk; Part number Norautron: N.A.
TP1-TP4 TP15 = TP_SMD_Ø1.0MM: 1.0mm circular SMD testpad; Manufacturer: Nordic Semiconductor; Manufacturer Part Number: N.A.; Pad Count: 1; Part Number: TP_SMD_Ø1.0MM; LatestRevisionDate: 2021-03-05; Published: 2013-06-11; Value: Ø1.0mm,SMD; Note: N.A.; Artikkelnr Noca: N.A.; Footprint Doc: TP_SMD_Ø1.0mm; Part number IPS: N.A.; ComponentLink1URL: N.A.; ComponentLink1Description: Datasheet; ComponentLink2URL: N.A.; ComponentLink2Description: Supplier link; HelpURL: N.A.; Supplier 1: N.A.; Supplier Part Number 1: N.A.; Supplier 2: N.A.; Supplier Part Number 2: N.A.; PartId: 100500475; Component Class: Connectors; Author: rsk; Part number Norautron: N.A.